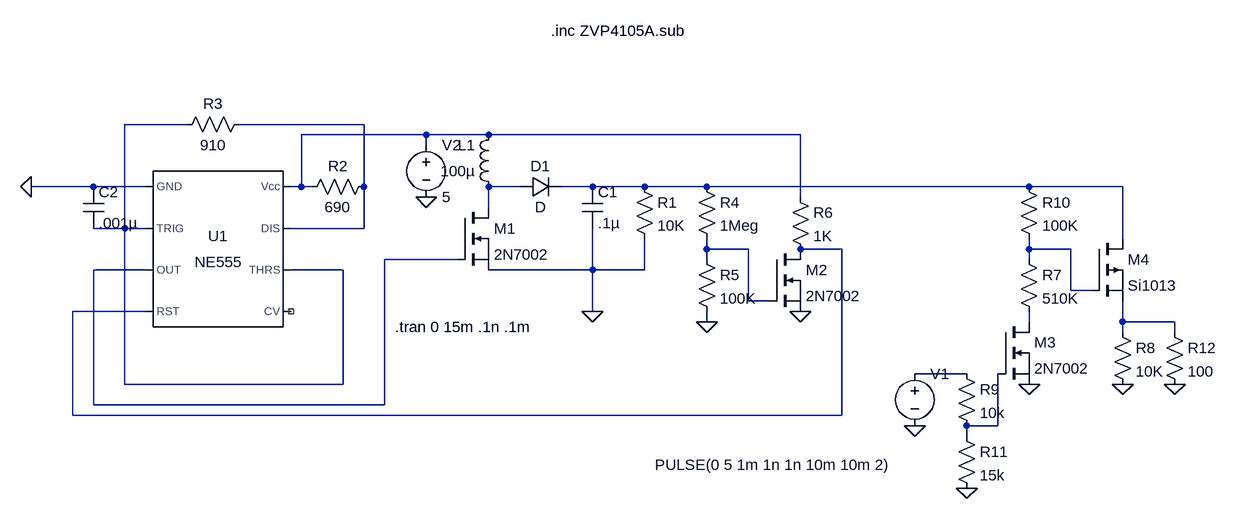
[diagram p0: schematic Simulation.asc]
Simulation.asc, the LTspice schematic file:
Version 4
SHEET 1 1160 680
WIRE -464 48 -560 48
WIRE -192 48 -384 48
WIRE -96 64 -288 64
WIRE 0 64 -96 64
WIRE 480 64 0 64
WIRE -96 80 -96 64
WIRE -608 144 -704 144
WIRE -528 144 -608 144
WIRE -288 144 -288 64
WIRE -288 144 -304 144
WIRE -272 144 -288 144
WIRE -192 144 -192 48
WIRE 48 144 0 144
WIRE 160 144 112 144
WIRE 240 144 160 144
WIRE 336 144 240 144
WIRE 832 144 336 144
WIRE 976 144 832 144
WIRE 480 160 480 64
WIRE 0 176 0 144
WIRE -560 208 -560 48
WIRE -560 208 -608 208
WIRE -528 208 -560 208
WIRE -192 208 -192 144
WIRE -192 208 -304 208
WIRE 976 224 976 144
WIRE 336 240 336 224
WIRE 400 240 336 240
WIRE 544 240 480 240
WIRE 832 240 832 224
WIRE 896 240 832 240
WIRE -48 256 -160 256
WIRE 336 256 336 240
WIRE 832 256 832 240
WIRE -528 272 -608 272
WIRE -224 272 -304 272
WIRE 160 272 160 208
WIRE 160 272 0 272
WIRE 240 272 240 224
WIRE 240 272 160 272
WIRE 896 304 896 240
WIRE 928 304 896 304
WIRE 400 320 400 240
WIRE 432 320 400 320
WIRE -528 336 -640 336
WIRE 160 336 160 272
WIRE 336 352 336 336
WIRE 832 352 832 336
WIRE 976 352 976 320
WIRE 1056 352 976 352
WIRE 976 368 976 352
WIRE 1056 368 1056 352
WIRE 736 432 656 432
WIRE -560 448 -560 208
WIRE -224 448 -224 272
WIRE -224 448 -560 448
WIRE -608 480 -608 272
WIRE -160 480 -160 256
WIRE -160 480 -608 480
WIRE -640 496 -640 336
WIRE 544 496 544 240
WIRE 544 496 -640 496
WIRE 784 512 784 432
WIRE 784 512 736 512
WIRE 736 528 736 512
FLAG 160 336 0
FLAG -96 160 0
FLAG -704 144 0
FLAG 336 352 0
FLAG 480 336 0
FLAG 832 448 0
FLAG 976 448 0
FLAG 656 512 0
FLAG 736 608 0
FLAG 1056 448 0
SYMBOL cap 144 144 R0
SYMATTR InstName C1
SYMATTR Value .1µ
SYMBOL ind 16 160 R180
WINDOW 0 36 80 Left 2
WINDOW 3 36 40 Left 2
SYMATTR InstName L1
SYMATTR Value 100µ
SYMATTR SpiceLine Rser=160m
SYMBOL diode 48 160 R270
WINDOW 0 32 32 VTop 2
WINDOW 3 0 32 VBottom 2
SYMATTR InstName D1
SYMBOL nmos -48 176 R0
SYMATTR InstName M1
SYMATTR Value 2N7002
SYMBOL res 224 128 R0
SYMATTR InstName R1
SYMATTR Value 10K
SYMBOL voltage -96 64 R0
WINDOW 123 0 0 Left 2
WINDOW 39 0 0 Left 2
SYMATTR InstName V2
SYMATTR Value 5
SYMBOL Misc\\NE555 -416 240 R0
SYMATTR InstName U1
SYMBOL res -288 160 R270
WINDOW 0 32 56 VTop 2
WINDOW 3 0 56 VBottom 2
SYMATTR InstName R2
SYMATTR Value 690
SYMBOL res -368 32 R90
WINDOW 0 0 56 VBottom 2
WINDOW 3 32 56 VTop 2
SYMATTR InstName R3
SYMATTR Value 910
SYMBOL cap -624 144 R0
SYMATTR InstName C2
SYMATTR Value .001µ
SYMBOL res 320 128 R0
SYMATTR InstName R4
SYMATTR Value 1Meg
SYMBOL res 320 240 R0
SYMATTR InstName R5
SYMATTR Value 100K
SYMBOL nmos 432 240 R0
SYMATTR InstName M2
SYMATTR Value 2N7002
SYMBOL res 464 144 R0
SYMATTR InstName R6
SYMATTR Value 1K
SYMBOL nmos 784 352 R0
SYMATTR InstName M3
SYMATTR Value 2N7002
SYMBOL res 960 352 R0
SYMATTR InstName R8
SYMATTR Value 10K
SYMBOL pmos 928 224 R0
SYMATTR InstName M4
SYMATTR Value Si1013
SYMBOL voltage 656 416 R0
WINDOW 3 -400 156 Left 2
WINDOW 123 0 0 Left 2
WINDOW 39 0 0 Left 2
SYMATTR Value PULSE(0 5 1m 1n 1n 10m 10m 2)
SYMATTR InstName V1
SYMBOL res 816 128 R0
SYMATTR InstName R10
SYMATTR Value 100K
SYMBOL res 720 416 R0
SYMATTR InstName R9
SYMATTR Value 10k
SYMBOL res 720 512 R0
SYMATTR InstName R11
SYMATTR Value 15k
SYMBOL res 1040 352 R0
SYMATTR InstName R12
SYMATTR Value 100
SYMBOL res 816 240 R0
SYMATTR InstName R7
SYMATTR Value 510K
TEXT -144 360 Left 2 !.tran 0 15m .1n .1m
TEXT 96 -96 Left 2 !.inc ZVP4105A.sub

The netlist it stands for:
* Simulation.asc
C1 N005 0 .1µ
L1 N004 N003 100µ Rser=160m
D1 N004 N005 D
M1 N004 N009 0 0 2N7002
R1 N005 0 10K
V2 N003 0 5
XU1 0 N001 N009 N007 NC_01 N001 N002 N003 NE555  ; pins GND TRIG OUT RST CV THRS DIS Vcc
R2 N003 N002 690
R3 N002 N001 910
C2 0 N001 .001µ
R4 N005 N006 1Meg
R5 N006 0 100K
M2 N007 N006 0 0 2N7002
R6 N003 N007 1K
M3 N010 N013 0 0 2N7002
R8 N011 0 10K
M4 N005 N008 N011 N011 Si1013
V1 N012 0 PULSE(0 5 1m 1n 1n 10m 10m 2)
R10 N005 N008 100K
R9 N012 N013 10k
R11 N013 0 15k
R12 N011 0 100
R7 N008 N010 510K
.model D D
.lib standard.dio
.model NMOS NMOS
.model PMOS PMOS
.lib standard.mos
.tran 0 15m .1n .1m
.inc ZVP4105A.sub
.lib NE555.sub
.backanno
.end